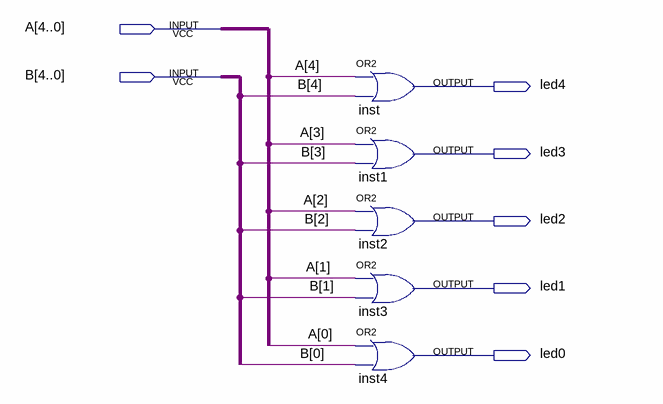
[diagram p0: schematic sheet]
// Quartus schematic orleds.bdf as structural Verilog: 5 symbols, 7 pins
module orleds (
  input  [4:0] A,
  input  [4:0] B,
  output led4,
  output led3,
  output led2,
  output led1,
  output led0
);

  or inst (led4, A[4], B[4]);
  or inst1 (led3, A[3], B[3]);
  or inst2 (led2, A[2], B[2]);
  or inst3 (led1, A[1], B[1]);
  or inst4 (led0, A[0], B[0]);
endmodule
